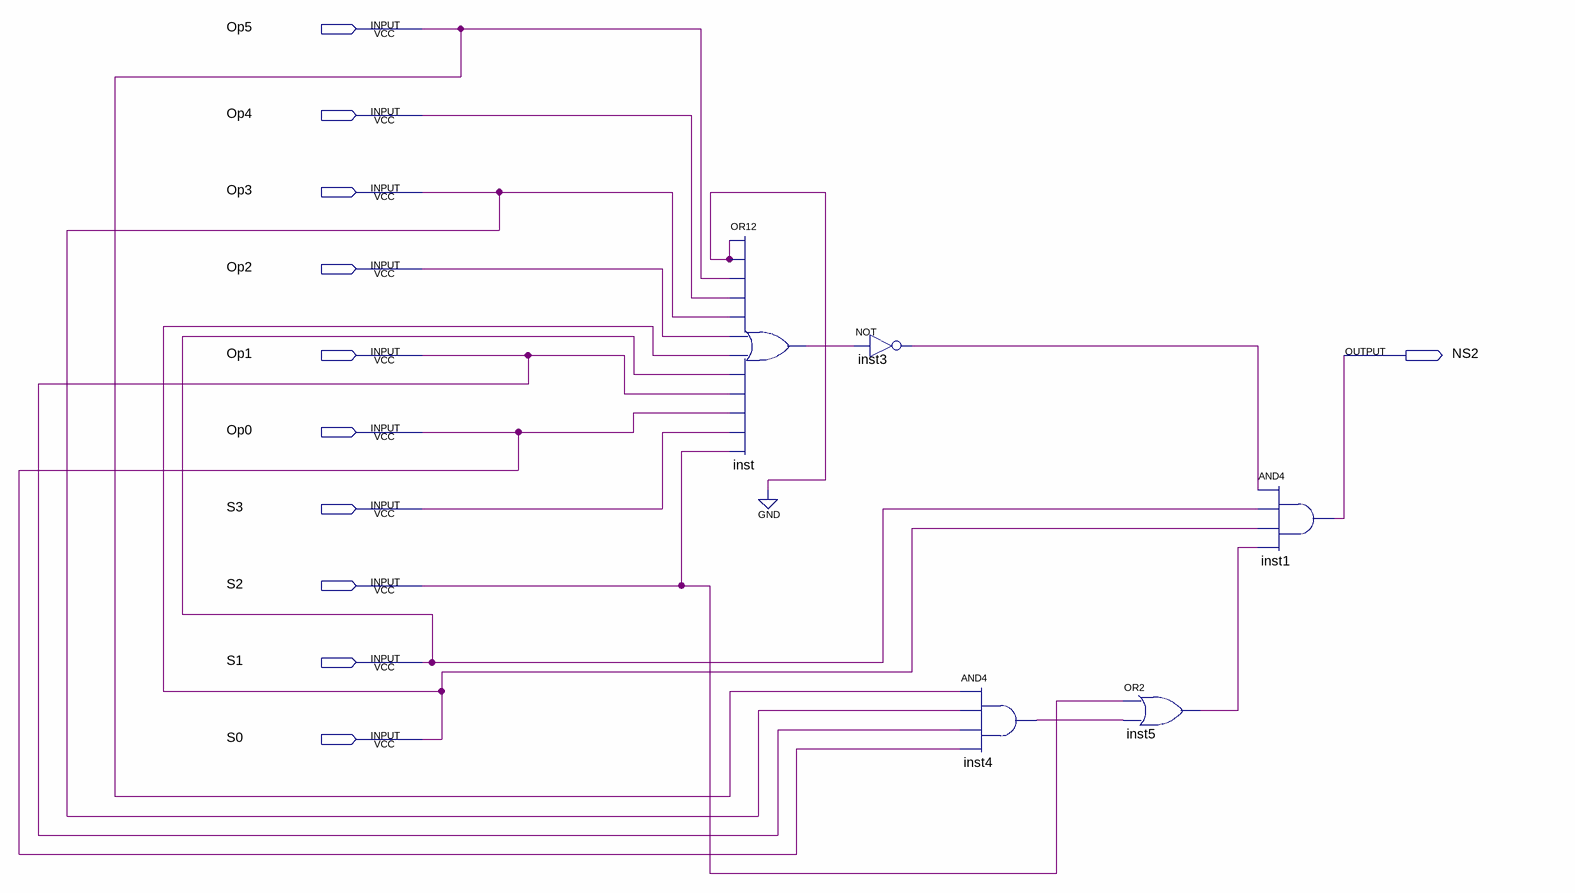
[diagram p0: schematic sheet]
// Quartus schematic NS2.bdf as structural Verilog: 5 symbols, 11 pins
module NS2 (
  input  Op5,
  input  Op4,
  input  Op3,
  input  Op2,
  input  Op1,
  input  Op0,
  input  S3,
  input  S2,
  input  S1,
  input  S0,
  output NS2
);

  wire inst3_out, inst4_out, inst5_out, inst_out;

  or inst (inst_out, 1'b0, 1'b0, Op5, Op4, Op3, Op2, S0, S1, Op1, Op0, S3, S2);
  not inst3 (inst3_out, inst_out);
  and inst4 (inst4_out, Op5, Op3, Op1, Op0);
  or inst5 (inst5_out, S2, inst4_out);
  and inst1 (NS2, inst3_out, S1, S0, inst5_out);
endmodule
